# Altium schematic sheet Buck_and_LDO.SchDoc
size A4; SheetNumber: 4; SheetTotal: 9
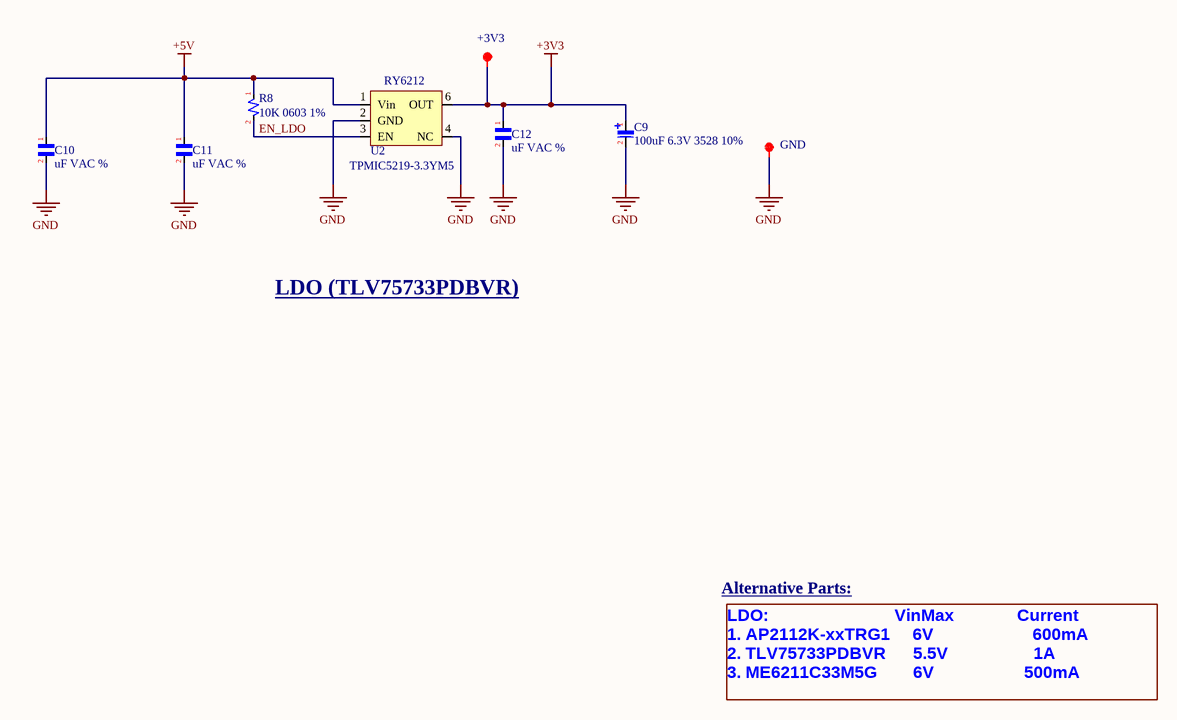
[diagram p0: Buck_and_LDO.SchDoc]

## Parts
C9  100uF 6.3V 3528 10%  [CAPPC3528X210N]
C10  uF VAC %  [C_X2_18X10X15.8_P15]
C11  uF VAC %  [C_X2_18X10X15.8_P15]
C12  uF VAC %  [C_X2_18X10X15.8_P15]
R8  10K 0603 1%  [R_0603]
TP5  +3V3  [TP_1mm_SMD]  (graphical)
TP6  GND  [TP_1mm_SMD]  (graphical)
U2  RY6212 3V3 SOT23-5  [RY6212 SOT23-5]  (value not drawn)

## Nets
+3V3: C9.1 C12.1 TP5.1 U2.6(OUT)
+5V: C10.1 C11.1 R8.1 U2.1(Vin)
GND: C9.2 C10.2 C11.2 C12.2 TP6.1 U2.2(GND) U2.4(NC)
EN_LDO: R8.2 U2.3(EN)

## Notes on the sheet
- (near U2) TPMIC5219-3.3YM5
- LDO (TLV75733PDBVR)
- Alternative Parts:
- LDO:                            VinMax              Current
  1. AP2112K-xxTRG1     6V                      600mA
  2. TLV75733PDBVR      5.5V                   1A
  3. ME6211C33M5G        6V                    500mA
- (in symbol RY6212 3V3 SOT23-5) RY6212

## Library data of the parts
C9 = Capacitor>> Polar
C10-C12 = Capacitor>> Non-Polar
R8 = Resistor>> General Purpose: RES 0603 20%
TP5 TP6 = Test point TP
U2 = RY6212 3V3 SOT23-5: The RY6212 highly accurate, low noise, CMOS LDO Voltage Regulators.